# EAGLE design STM-SIradio (EAGLE 6.5.0)
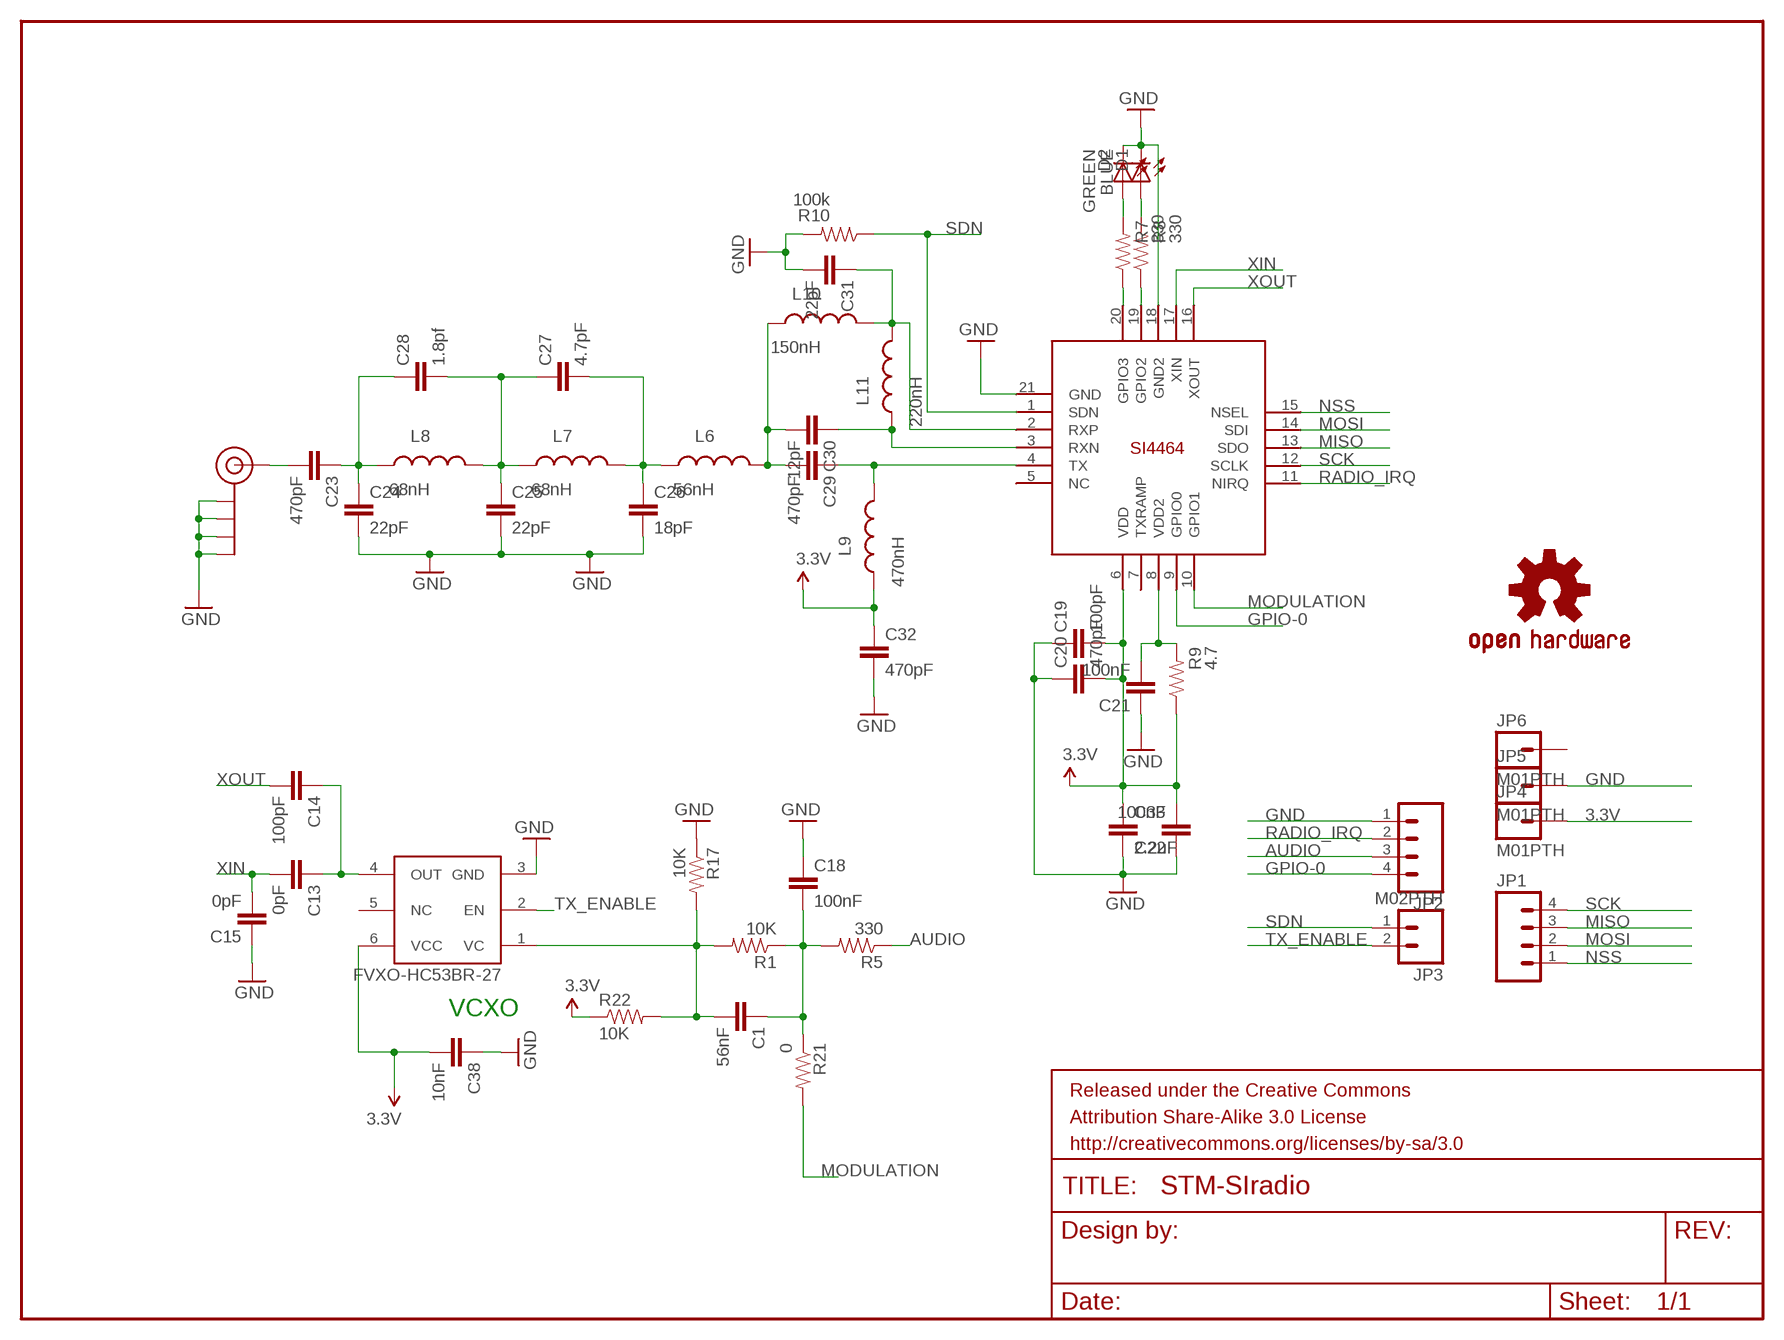
[diagram p0: schematic, sheet 1]

## Parts
C1  56nF  CAP0603-CAP  [0603-CAP]
C13  0pF  CAP0603-CAP  [0603-CAP]
C14  100pF  CAP0603-CAP  [0603-CAP]
C15  0pF  CAP0603-CAP  [0603-CAP]
C18  100nF  CAP0603-CAP  [0603-CAP]
C19  100pF  CAP0603-CAP  [0603-CAP]
C20  470pF  CAP0603-CAP  [0603-CAP]
C21  100nF  CAP0603-CAP  [0603-CAP]
C22  100nF  CAP0603-CAP  [0603-CAP]
C23  470pF  CAP0603-CAP  [0603-CAP]
C24  22pF  CAP0603-CAP  [0603-CAP]
C25  22pF  CAP0603-CAP  [0603-CAP]
C26  18pF  CAP0603-CAP  [0603-CAP]
C27  4.7pF  CAP0603-CAP  [0603-CAP]
C28  1.8pf  CAP0603-CAP  [0603-CAP]
C29  470pF  CAP0603-CAP  [0603-CAP]
C30  12pF  CAP0603-CAP  [0603-CAP]
C31  22pF  CAP0603-CAP  [0603-CAP]
C32  470pF  CAP0603-CAP  [0603-CAP]
C33  2.2uF  2.2UF-CERCAP-10009  [1206]
C38  10nF  CAP0603-CAP  [0603-CAP]
D1  BLUE  LED-BLUE0603  [LED-0603]
D2  GREEN  LED-GREEN0603  [LED-0603]
FRAME1  FRAME-LETTER  [CREATIVE_COMMONS]
FVXO-HC53BR-27  VCXO-SMDSMD3X  [VCXO-SMD-5X3.2]
J$2  SMA_EDGE  [SMA-EDGE]
JP1  M04PTH  [1X04]
JP2  M04PTH  [1X04]
JP3  M02PTH  [1X02]
JP4  M01PTH  [1X01]
JP5  M01PTH  [1X01]
JP6  M01PTH  [1X01]
L6  56nH  INDUCTOR0603  [0603]
L7  68nH  INDUCTOR0603  [0603]
L8  68nH  INDUCTOR0603  [0603]
L9  470nH  INDUCTOR0603  [0603]
L10  150nH  INDUCTOR0603  [0603]
L11  220nH  INDUCTOR0603  [0603]
LOGO1  OSHW-LOGOL  [OSHW-LOGO-L]
R1  10K  RESISTOR0603  [0603-RES]
R5  330  RESISTOR0603  [0603-RES]
R7  330  RESISTOR0603-RES  [0603-RES]
R8  330  RESISTOR0603-RES  [0603-RES]
R9  4.7  RESISTOR0603-RES  [0603-RES]
R10  100k  RESISTOR0603-RES  [0603-RES]
R17  10K  RESISTOR0603  [0603-RES]
R21  0  RESISTOR0603  [0603-RES]
R22  10K  RESISTOR0603  [0603-RES]
U$3  SI4464  [QFN20+GNDPAD]

## Nets
3.3V: C19.2 C20.2 C22.2 C32.1 C33.1 C38.2 FVXO-HC53BR-27.6(VCC) JP4.1 L9.1 R9.1 R22.1 U$3.6(VDD)
AUDIO: JP2.3 R5.1
GND: C15.1 C18.1 C19.1 C20.1 C21.1 C22.1 C24.2 C25.2 C26.2 C31.2 C32.2 C33.2 C38.1 D1.C D2.C FVXO-HC53BR-27.3(GND) J$2.GND@0(GND) J$2.GND@1(GND) J$2.GND@2(GND) J$2.GND@3(GND) JP2.1 JP5.1 R10.2 R17.1 U$3.18(GND2) U$3.21(GND)
GPIO-0: JP2.4 U$3.9(GPIO0)
MISO: JP1.3 U$3.13(SDO)
MODULATION: R21.2 U$3.10(GPIO1)
MOSI: JP1.2 U$3.14(SDI)
N$1: C1.2 FVXO-HC53BR-27.1(VC) R1.2 R17.2 R22.2
N$6: C1.1 C18.2 R1.1 R5.2 R21.1
N$13: C13.1 C14.1 FVXO-HC53BR-27.4(OUT)
N$18: C23.2 J$2.SIG(SIGNAL)
N$19: C23.1 C24.1 C28.1 L8.1
N$21: C25.1 C27.1 C28.2 L7.1 L8.2
N$22: C26.1 C27.2 L6.1 L7.2
N$23: C29.1 L9.2 U$3.4(TX)
N$24: C29.2 C30.2 L6.2 L10.1
N$25: C30.1 L11.1 U$3.3(RXN)
N$26: C31.1 L10.2 L11.2 U$3.2(RXP)
N$31: D1.A R8.2
N$32: D2.A R7.2
N$33: R7.1 U$3.20(GPIO3)
N$34: R8.1 U$3.19(GPIO2)
N$39: C21.2 R9.2 U$3.8(VDD2)
NSS: JP1.1 U$3.15(NSEL)
RADIO_IRQ: JP2.2 U$3.11(NIRQ)
SCK: JP1.4 U$3.12(SCLK)
SDN: JP3.1 R10.1 U$3.1(SDN)
TX_ENABLE: FVXO-HC53BR-27.2(EN) JP3.2
XIN: C13.2 C15.2 U$3.17(XIN)
XOUT: C14.2 U$3.16(XOUT)
Unconnected: FVXO-HC53BR-27.5(NC) JP6.1 U$3.5(NC ) U$3.7(TXRAMP)

## Notes on the sheet
- VCXO

## Library data of the parts
C1 C13-C15 C18-C32 C38 = SparkFun-Capacitors:CAP: Capacitor Standard 0603 ceramic capacitor, and 0.1" leaded capacitor.
C33 = SparkFun-Capacitors:2.2UF-CER: 2.2uF Ceramic SMT CAP-07888- 10V, 20% (0603) CAP-10009- 50V, 10% (1206); PROD_ID: CAP-10009
D1 = SparkFun-LED:LED-BLUE: Blue LEDs for production use Various blue LEDs stocked by SparkFun production 0603 - DIO-08575 Rebel - DIO-09553 1206 - DIO-09911; PROD_ID: DIO-08575
D2 = SparkFun-LED:LED-GREEN: Various green LEDs 0603- DIO-00821 LARGE- DIO-00862 LILYPAD- DIO-09910; PROD_ID: DIO-00821
FRAME1 = SparkFun-Aesthetics:FRAME-LETTER: Schematic Frame Standard 8.5x11 US Letter frame
FVXO-HC53BR-27 = SparkFun-FreqCtrl:VCXO-SMD
J$2 = SparkFun-Connectors:SMA_EDGE: SMA Antenna Connector End launch SMA connector. The paste layer has been removed so that the connector can be hand soldered onto the board after reflow.
JP1 JP2 = myconnectors:M04: Header 4 Standard 4-pin 0.1" header. Use with straight break away headers (SKU : PRT-00116), right angle break away headers (PRT-00553), swiss pins (PRT-00743), machine pins (PRT-00117), and female headers (PRT-00115). Molex polarized connector foot print use with SKU : PRT-08231 with associated crimp pins and housings. 1MM SMD Version SKU: PRT-10208
JP3 = myconnectors:M02: Standard 2-pin 0.1" header. Use with - straight break away headers ( PRT-00116) - right angle break away headers (PRT-00553) - swiss pins (PRT-00743) - machine pins (PRT-00117) - female headers (PRT-00115) Molex polarized connector foot print use with: PRT-08233 with associated crimp pins and housings. 2.54_SCREWTERM for use with PRT-10571. 3.5mm Screw Terminal footprints for PRT-08084 5mm Screw Terminal footprints for use with PRT-08433
JP4-JP6 = myconnectors:M01: Header 1 Standard 1-pin 0.1" header. Use with straight break away headers (SKU : PRT-00116), right angle break away headers (PRT-00553), swiss pins (PRT-00743), machine pins (PRT-00117), and female headers (PRT-00115).
L6-L11 = SparkFun-Passives:INDUCTOR: Inductors Basic Inductor/Choke - 0603 and 1206. Footprints are not proven and vary greatly between part numbers. SRN6045- 33uH, 20% 1.4A
LOGO1 = SparkFun-Aesthetics:OSHW-LOGO: Open Source Hardware Logo This logo indicates the piece of hardware it is found on incorporates a OSHW license and/or adheres to the definition of open source hardware found here: http://freedomdefined.org/OSHW
R1 R5 R17 R21 R22 = SparkFun-Resistors:RESISTOR: Resistor Basic schematic elements and footprints for 0603, 1206, and PTH resistors.
R7-R10 = SparkFun-Passives:RESISTOR: Resistor Basic schematic elements and footprints for 0603, 1206, and PTH resistors.
U$3 = Ava:SI4464

## Net classes
1 vcc: width 0.381 mm
2 3.3v: width 0.406 mm

## Board
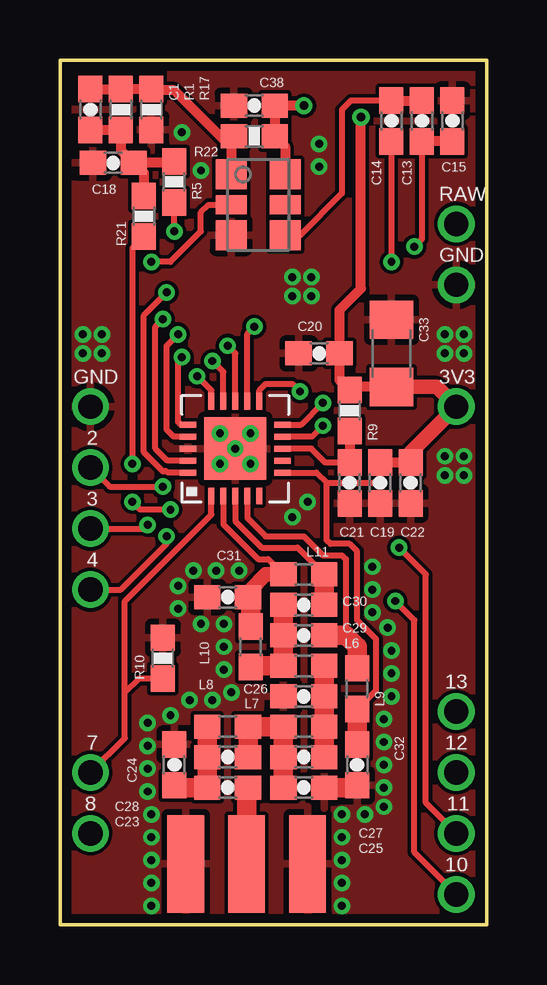
[diagram p1: board, top side]
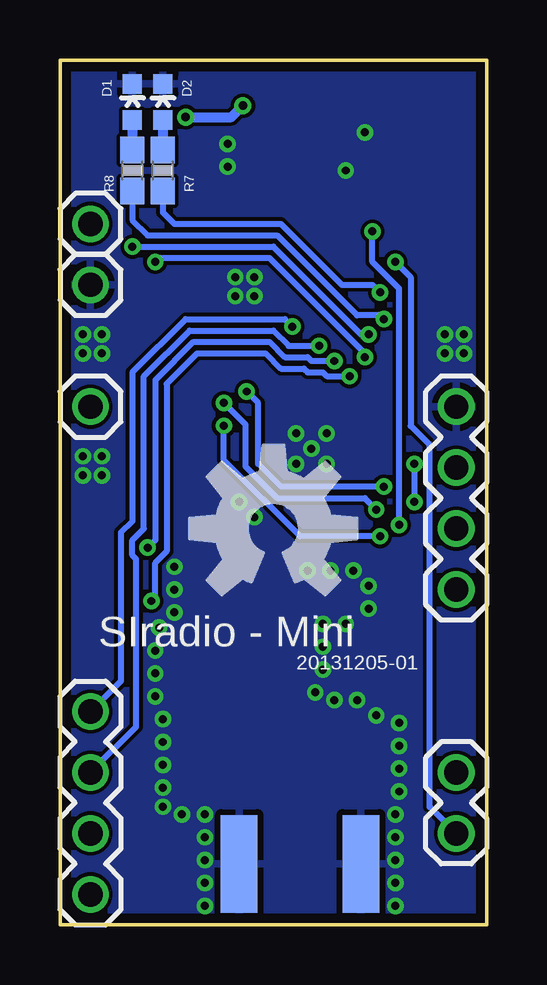
[diagram p2: board, bottom side, seen from below]

Size 17.78 x 36.04 mm. Coordinates in mm from the lower left corner, seen from the top.
Outline: 0,36.04 0,0 17.78,0 17.78,36.04 0,36.04
Copper layers (1*16): Top 0.0356mm / dielectric 1.5011mm / Bottom 0.0356mm
Design rules "Laen OSH *": minimum track width 6mil, minimum drill 13mil, track to track 6mil, track to pad 6mil, pad to pad 6mil, via to via 6mil, smd to smd 6mil, copper to edge 15mil, drill to drill 6mil, minimum pad ring 7mil, minimum via ring 7mil, stop-mask expansion 4mil, vias tented up to drill 15mil, thermal gap 10mil

### Footprints (pad centres in the part's own frame; a part is rotated, then mirrored left to right if it is on the bottom)
0603-CAP = smd 1.1 x 1: 1 -0.85,0; 2 0.85,0
1206 = smd 1.6 x 1.8: 1 -1.4,0; 2 1.4,0
LED-0603 = smd 0.8 x 0.8: A 0,-0.75; C 0,0.75
VCXO-SMD-5X3.2 = smd 1.24 x 1.29: 1 -1.27,-1.125; 3 1.27,-1.125; 4 1.27,1.125; 6 -1.27,1.125 | smd 0.8 x 1.29: 2 0,-1.125; 5 0,1.125
SMA-EDGE = smd 1.524 x 4.064: GND@0 0,0; GND@1 5.08,0; SIG 2.54,0 | smd 1.524 x 4.064 bottom: GND@2 0,0; GND@3 5.08,0
1X04 = drill 1.016 pad 1.524: 1 0,0; 2 2.54,0; 3 5.08,0; 4 7.62,0
1X02 = drill 1.016 pad 1.524: 1 0,0; 2 2.54,0
1X01 = drill 1.016 pad 1.524: 1 0,0
0603 = smd 1.1 x 1: 1 -0.85,0; 2 0.85,0
0603-RES = smd 1.1 x 1: 1 -0.85,0; 2 0.85,0
QFN20+GNDPAD = smd 0.7 x 0.25: 1 -1.97,1; 2 -1.97,0.5; 3 -1.97,0; 4 -1.97,-0.5; 5 -1.97,-1; 11 1.97,-1; 12 1.97,-0.5; 13 1.97,0; 14 1.97,0.5; 15 1.97,1 | smd 0.25 x 0.7: 6 -1,-1.97; 7 -0.5,-1.97; 8 0,-1.97; 9 0.5,-1.97; 10 1,-1.97; 16 1,1.97; 17 0.5,1.97; 18 0,1.97; 19 -0.5,1.97; 20 -1,1.97 | smd 2.6 x 2.6: 21 0,0

### Placement (x,y rotation side)
C1  1.27,33.97 90 top
C13  15.08,33.5 270 top
C14  13.81,33.5 270 top
C15  16.35,33.5 270 top
C18  2.22,31.75 0 top
C19  13.34,18.41 90 top
C20  10.79,23.81 0 top
C21  12.06,18.41 90 top
C22  14.61,18.41 90 top
C23  6.99,5.71 0 top
C24  4.76,6.67 90 top
C25  10.16,5.71 0 top
C26  10.16,9.53 180 top
C27  10.16,6.99 0 top
C28  6.99,6.99 0 top
C29  10.16,12.06 180 top
C30  10.16,13.34 180 top
C31  6.99,13.65 180 top
C32  12.38,6.67 270 top
C33  13.81,23.81 90 top
C38  8.1,34.13 0 top
D1  14.76,34.29 0 bottom
D2  13.49,34.29 0 bottom
FRAME1  21.59,-12.7 0 top  (outside the outline)
FVXO-HC53BR-27  8.26,30 270 top
J$2  10.32,2.54 180 top
JP1  16.51,1.27 90 bottom
JP2  1.27,21.59 270 bottom
JP3  1.27,6.35 270 bottom
JP4  16.51,21.59 0 bottom
JP5  16.51,26.67 0 bottom
JP6  16.51,29.21 0 bottom
L6  10.16,10.79 180 top
L7  10.16,8.26 0 top
L8  6.99,8.26 0 top
L9  12.38,9.84 90 top
L10  7.94,11.59 90 top
L11  10.16,14.61 180 top
LOGO1  8.89,16.51 0 bottom
R1  2.54,33.97 90 top
R5  4.76,30.96 90 top
R7  13.49,31.43 90 bottom
R8  14.76,31.43 90 bottom
R9  12.06,21.43 270 top
R10  4.29,11.11 90 top
R17  3.81,33.97 90 top
R21  3.49,29.53 270 top
R22  8.1,32.86 180 top
U$3  7.3,19.84 90 top

### Tracks (layer width: path | path; a pad name or v marks a point on that pad's centre or on a via)
3.3V  (via drill 0.36)
  Top 0.254: L9.1 13.18,9.79 13.18,11.91 12.38,12.7 12.38,15.56 12.06,15.88 11.27,15.88 11.11,16.03 11.11,18.41 | C22.2 14.61,19.37 | C19.2 13.34,18.57 13.18,18.41 11.11,18.41 | U$3.6 10.68,18.84 11.11,18.41
  Top 0.406: C22.2 C19.2 | C33.1 12.2,22.41 | v12.54,33.66 12.54,26.51 11.64,25.61 C20.2 11.64,22.7 R9.1 | v10.16,34.13 C38.2 R22.1 9.38,32.43 FVXO-HC53BR-27.6
  Top 0.61: C33.1 15.69,22.41 JP4.1 14.61,19.68 C22.2 | 12.2,22.41 R9.1
  Top 0.813: C32.1 L9.1
  Bottom 0.406: v12.54,33.66 10.64,33.66 v10.16,34.13
AUDIO  (via drill 0.33)
  Top 0.254: v4.76,28.89 R5.1 | JP2.3 3.49,16.51 v3.65,16.67
  Bottom 0.254: v3.65,16.67 3.65,26.51 4.76,27.62 v4.76,28.89
GND  (via drill 0.33)
  Top 0.813: C25.2 12.28,5.71 C32.2
  other vias: 13.49,5.71 13.49,4.92 11.75,4.6 11.75,3.65 11.75,2.7 11.75,0.79 13.49,6.67 13.49,7.62 13.49,8.57 3.65,7.46 3.65,6.51 3.65,5.56 3.81,0.79 3.81,2.7 3.81,1.75 3.65,8.41 3.81,4.6 4.6,8.73 5.4,9.37 6.35,9.37 6.83,10.64 6.83,11.59 6.83,12.54 5.87,12.54 4.92,13.18 4.92,14.13 5.56,14.76 6.51,14.76 7.46,14.76 3.81,3.65 7.14,9.68 11.75,1.75 13.81,9.53 13.81,10.48 13.81,11.43 13.65,12.38 13.02,13.02 13.02,13.97 13.02,14.92 12.7,4.6 16.83,23.81 16.83,19.53 16.03,23.81 16.83,24.61 16.03,24.61 16.03,19.53 16.03,18.73 16.83,18.73 7.94,19.21 7.94,20.48 7.3,19.84 6.67,20.48 6.67,19.21 9.68,16.99 10.32,17.62 10.48,26.99 9.68,26.99 5.08,33.02 5.87,31.43 10.79,32.54 10.79,31.59 1.75,23.81 0.95,23.81 1.75,24.61 0.95,24.61 9.68,26.19 10.48,26.19
  pour Top: 0,0 17.78,0 17.78,36.2 0,36.2
  pour Bottom: 0,0 17.78,0 17.78,36.2 0,36.2
GPIO-0  (via drill 0.33)
  Top 0.254: v10.95,20.8 10.5,20.34 U$3.9 | JP2.4 2.54,13.97 4.45,15.88 v4.45,16.19
  Bottom 0.254: v4.45,16.19 7.78,16.19 10.95,19.37 v10.95,20.8
MISO  (via drill 0.33)
  Top 0.254: U$3.13 7.3,23.81 v6.99,24.13
  Bottom 0.254: v6.99,24.13 8.26,24.13 8.89,24.77 12.38,24.77 14.29,22.86 14.29,16.51 14.76,16.03 14.76,15.4 14.61,15.24 14.61,8.26 JP1.3
MODULATION  (via drill 0.33)
  Top 0.254: U$3.10 10.05,20.84 v10.95,21.75 | v3.02,19.21 3.02,28.2 R21.2 | v4.6,17.3 3.33,17.3 v3.02,17.62
  Bottom 0.254: v10.95,21.75 10.05,20.84 10.05,19.1 8.73,17.78 5.08,17.78 v4.6,17.3 | v3.02,19.21 v3.02,17.62
MOSI  (via drill 0.33)
  Top 0.254: v14.13,15.72 15.24,14.61 15.24,5.08 JP1.2 | U$3.14 6.8,23.04 v6.35,23.5
  Bottom 0.254: v6.35,23.5 7.3,23.5 7.46,23.65 8.41,23.65 9.05,24.29 12.22,24.29 13.81,22.7 13.81,16.03 v14.13,15.72
N$1
  Top 0.406: C1.2 R1.2 R17.2 3.87,34.77 4.76,34.77 6.78,32.74 7.13,32.74 | R22.2 7.13,32.74 | 7.13,32.74 FVXO-HC53BR-27.1
N$6
  Top 0.406: C1.1 R1.1 2.54,32.28 C18.2 | C18.2 3.49,31.33 R21.1 | R5.2 4.76,31.75 C18.2
N$13
  Top 0.254: C14.1 12.12,34.35 11.75,33.97 11.75,30.48 10,28.73 FVXO-HC53BR-27.4
  Top 0.406: C14.1 C13.1
N$18
  Top 0.813: J$2.SIG 7.78,5.66 C23.2
N$19
  Top 0.813: C24.1 4.87,5.71 C23.1 C28.1 L8.1
N$21
  Top 0.813: C28.2 L8.2 L7.1 C27.1 C25.1
N$22
  Top 0.813: C27.2 L7.2 C26.1 L6.1
N$23
  Top 0.254: U$3.4 7.8,16.96 8.57,16.19 10.16,16.19 10.95,15.4 11.75,15.4 11.91,15.24 11.91,12.06
  Top 0.813: L9.2 12.38,11.59 11.91,12.06 C29.1
N$24
  Top 0.813: L10.1 7.99,10.79 L6.2 C29.2 C30.2
N$25
  Top 0.254: U$3.3 7.3,16.83 8.41,15.72 9.9,15.72 L11.1
  Top 0.813: C30.1 L11.1
N$26
  Top 0.254: U$3.2 6.8,16.69 8.26,15.24 8.68,15.24 L11.2
  Top 0.61: 7.94,13.55 7.94,13.97 8.57,14.61 L11.2
  Top 0.813: L10.2 7.94,13.55 C31.1
N$31
  Bottom 0.406: D1.A R8.2
N$32
  Bottom 0.406: D2.A R7.2
N$33  (via drill 0.33)
  Top 0.254: U$3.20 4.49,18.84 4.45,18.89 4.29,18.89 3.49,19.68 3.49,25.4 v4.45,26.35
  Bottom 0.254: R7.1 13.49,29.69 13.02,29.21 8.57,29.21 6.03,26.67 4.76,26.67 v4.45,26.35
N$34  (via drill 0.33)
  Top 0.254: U$3.19 4.47,19.34 3.97,19.84 3.97,24.92 v4.29,25.24
  Bottom 0.254: R8.1 14.76,29.37 14.13,28.73 8.73,28.73 5.4,25.4 4.45,25.4 v4.29,25.24
N$39
  Top 0.254: 11.8,20.32 R9.2 | C21.2 11.06,19.27 10.48,19.84 U$3.8
  Top 0.406: R9.2 C21.2
NSS  (via drill 0.33)
  Top 0.254: v13.97,13.49 14.76,12.7 14.76,3.02 JP1.1 | U$3.15 6.3,22.27 v5.71,22.86
  Bottom 0.254: v13.97,13.49 13.81,13.65 13.81,15.08 13.34,15.56 13.34,22.54 12.06,23.81 9.21,23.81 8.57,23.18 7.62,23.18 7.46,23.02 6.83,23.02 6.67,22.86 v5.71,22.86
RADIO_IRQ  (via drill 0.33)
  Top 0.254: U$3.11 8.3,22.27 8.57,22.54 9.68,22.54 v10,22.23 | v4.29,18.26 2.06,18.26 JP2.2
  Bottom 0.254: v4.29,18.26 8.57,18.26 9.53,19.21 9.53,21.75 v10,22.23
SCK  (via drill 0.33)
  Top 0.254: U$3.12 7.8,24.63 v8.1,24.92
  Bottom 0.254: v8.1,24.92 8.41,25.24 12.54,25.24 14.76,23.02 14.76,16.83 15.24,16.35 15.24,10.16 JP1.4
SDN
  Top 0.254: 2.7,9.68 2.7,7.78 JP3.1 | 2.7,9.68 2.7,13.49 6.3,17.1 U$3.1 | R10.1 3.28,10.26 2.7,9.68
TX_ENABLE  (via drill 0.33)
  Top 0.254: v3.81,27.62 4.6,27.62 5.87,28.89 5.87,29.69 6.19,30 FVXO-HC53BR-27.2
  Bottom 0.254: v3.81,27.62 3.17,26.99 3.17,20.8 2.38,20 2.38,4.92 JP3.2
XIN  (via drill 0.33)
  Top 0.254: C13.2 15.08,28.57 v14.76,28.26 | U$3.17 4.74,20.34 4.45,20.64 4.45,24.13 v4.92,24.61
  Top 0.406: C15.2 C13.2
  Bottom 0.254: v14.76,28.26 8.89,28.26 5.24,24.61 v4.92,24.61
XOUT  (via drill 0.33)
  Top 0.254: C14.2 v13.81,27.62 | U$3.16 5.03,20.84 4.92,20.95 4.92,23.5 v5.08,23.65
  Bottom 0.254: v5.08,23.65 5.08,23.81 9.05,27.78 13.65,27.78 v13.81,27.62

### Text on the board
tPlace: RAW | GND | GND | 3V3 | 2 | 3 | 4 | 13 | 7 | 12 | 8 | 11 | 10
bPlace: SIradio - Mini | 20131205-01